# EAGLE design MPU6050 (EAGLE 9.3.0)
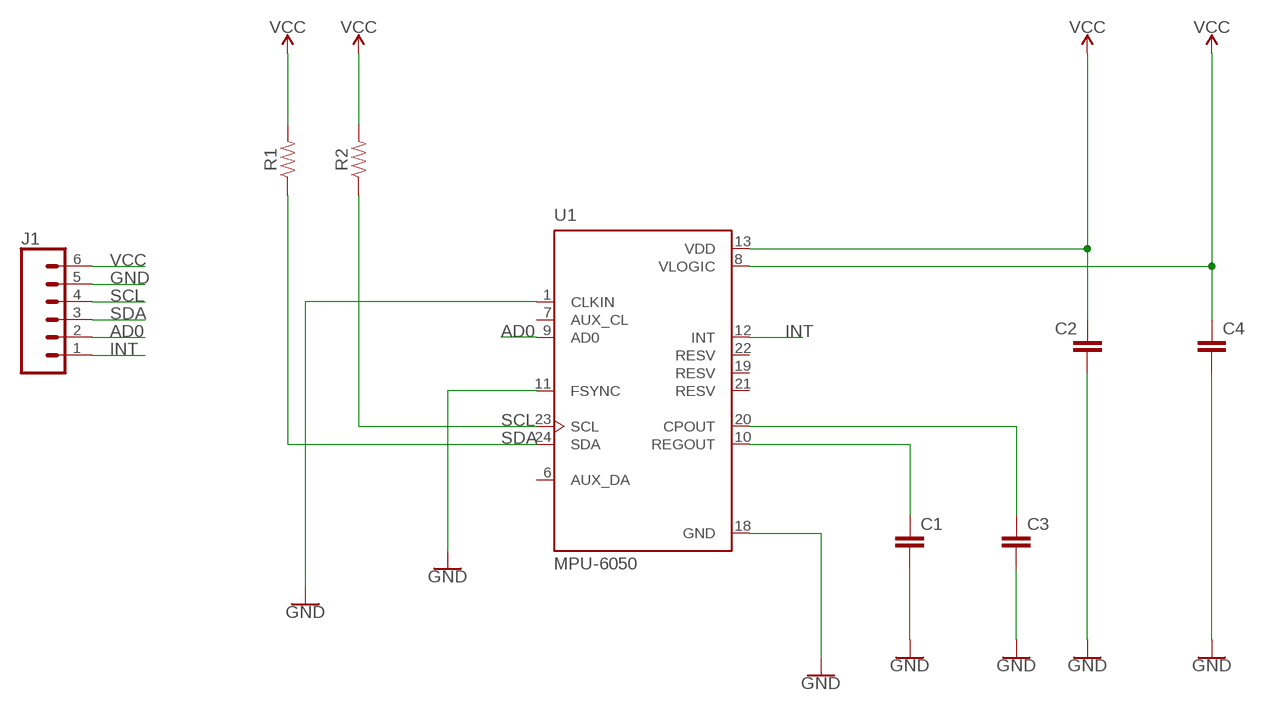
[diagram p0: schematic, sheet 1]

## Parts
C1  C-EU050-035X075  [C050-035X075]
C2  C-EU050-035X075  [C050-035X075]
C3  C-EU050-035X075  [C050-035X075]
C4  C-EU050-035X075  [C050-035X075]
J1  CONN_06NO_SILK_FEMALE_PTH  [1X06_NO_SILK]
R1  RESISTORAXIAL-0.3  [AXIAL-0.3]
R2  RESISTORAXIAL-0.3  [AXIAL-0.3]
U1  MPU-6050  [QFN50P400X400X95-24N]

## Nets
AD0: J1.2 U1.9(AD0)
GND: C1.2 C2.2 C3.2 C4.2 J1.5 U1.1(CLKIN) U1.11(FSYNC) U1.18(GND)
INT: J1.1 U1.12(INT)
N$1: C1.1 U1.10(REGOUT)
N$2: C3.1 U1.20(CPOUT)
SCL: J1.4 R2.P$1 U1.23(SCL)
SDA: J1.3 R1.P$1 U1.24(SDA)
VCC: C2.1 C4.1 J1.6 R1.P$2 R2.P$2 U1.8(VLOGIC) U1.13(VDD)
Unconnected: U1.6(AUX_DA) U1.7(AUX_CL) U1.19(RESV) U1.21(RESV) U1.22(RESV)

## Library data of the parts
C1-C4 = rcl:C-EU: CAPACITOR, European symbol; SPICEPREFIX: C
J1 = SparkFun-Connectors:CONN_06: Multi connection point. Often used as Generic Header-pin footprint for 0.1 inch spaced/style header connections On any of the 0.1 inch spaced packages, you can populate with these: Break Away Headers - Straight <https://www.sparkfun.com/products/116> (PRT-00116) Break Away Male Headers - Right Angle <https://www.sparkfun.com/products/553> (PRT-00553) Female Headers <https://www.sparkfun.com/products/115> (PRT-00115) Break Away Headers - Machine Pin <https://www.sparkfun.com/products/117> (PRT-00117) Break Away Female Headers - Swiss Machine Pin <https://www.sparkfun.com/products/743> (PRT-00743) Arduino Stackable Header - 6 Pin <https://www.sparkfun.com/products/9280> (PRT-09280) For SCREWTERMINALS and SPRING TERMINALS visit here: Screw Terimnals on SparkFun.com <https://www.sparkfun.com/search/results?term=Screw+Terminals> (5mm/3.5mm/2.54mm spacing) This device is also useful as a general connection point to wire up your design to another part of your project. Our various solder wires solder well into these plated through hole pads. Hook-Up Wire - Assortment (Stranded, 22 AWG) <https://www.sparkfun.com/products/11375> (PRT-11375) Hook-Up Wire - Assortment (Solid Core, 22 AWG) <https://www.sparkfun.com/products/11367> (PRT-11367) View the entire wire category on our website here <https://www.sparkfun.com/categories/141>; PROD_ID: CONN-08437
R1 R2 = SparkFun-Resistors:RESISTOR: Generic Resistor Package
U1 = MPU-6050:MPU-6050: MPU-6050 Six-Axis (Gyro + Accelerometer) MEMS MotionTracking™ Devices; DESCRIPTION: 3-axis gyroscope, 3-axis accelerometer in a 4x4x0.9 housing; DIGI-KEY_PART_NUMBER: 1428-1007-1-ND; DIGI-KEY_PURCHASE_URL: https://www.digikey.co.uk/product-detail/en/tdk-invensense/MPU-6050/1428-1007-1-ND/4038010?utm_source=snapeda&utm_medium=aggregator&utm_campaign=symbol; MF: TDK InvenSense; MP: MPU-6050; PACKAGE: QFN-24 InvenSense

## Board
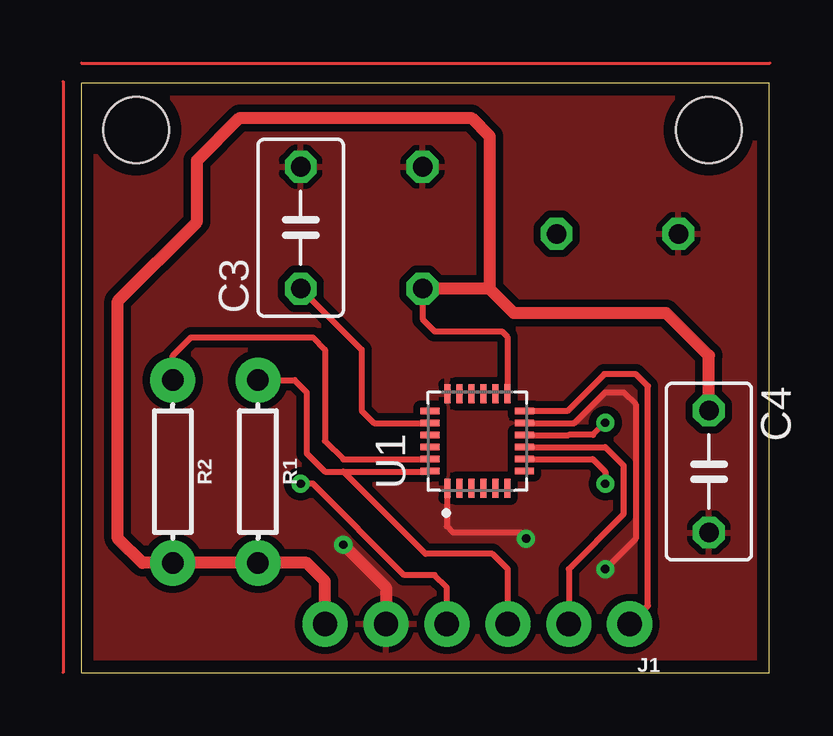
[diagram p1: board, top side]
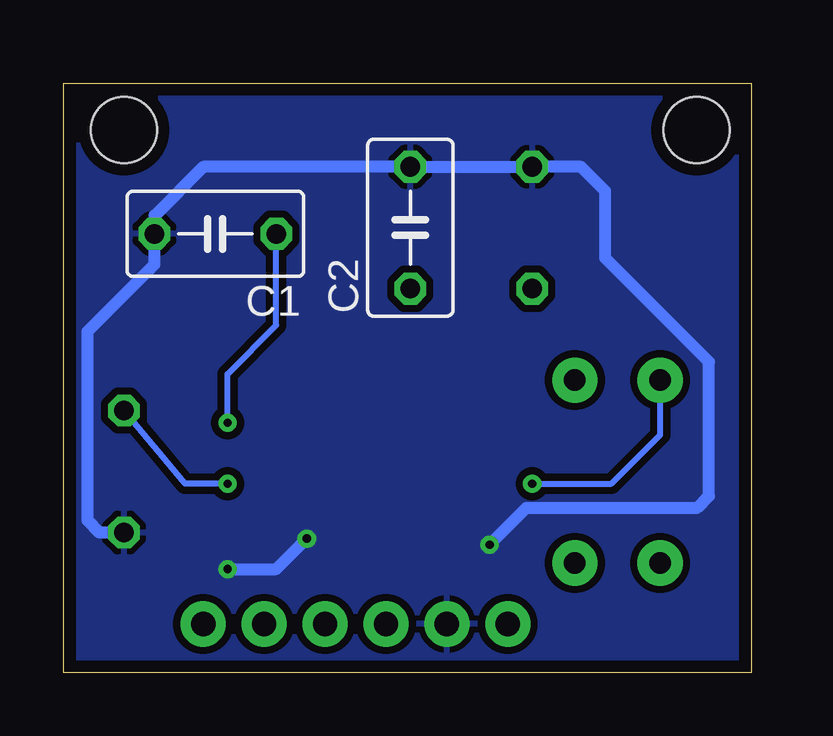
[diagram p2: board, bottom side, seen from below]

Size 28.68 x 24.56 mm. Coordinates in mm from the lower left corner, seen from the top.
Outline: 0,0 28.68,0 28.68,24.56 0,24.56 0,0
Copper layers (1*16): Top 0.035mm / dielectric 1.5mm / Bottom 0.035mm
Design rules "default *": minimum track width 8mil, minimum drill 0.35mm, track to track 8mil, track to pad 8mil, pad to pad 8mil, via to via 8mil, smd to smd 0mil, copper to edge 20mil, drill to drill 6mil, minimum pad ring 10mil, minimum via ring 8mil, stop-mask expansion 4mil, vias tented up to drill 0mil, thermal gap 10mil
Holes 2.75 mm at 2.29,22.61 26.16,22.61

### Footprints (pad centres in the part's own frame; a part is rotated, then mirrored left to right if it is on the bottom)
C050-035X075 = drill 0.813 octagon: 1 -2.54,0; 2 2.54,0
1X06_NO_SILK = drill 1.016 pad 1.88: 1 0,0; 2 2.54,0; 3 5.08,0; 4 7.62,0; 5 10.16,0; 6 12.7,0
AXIAL-0.3 = drill 0.9 pad 1.88: P$1 -3.81,0; P$2 3.81,0
QFN50P400X400X95-24N = smd 0.79 x 0.26: 1 -1.97,1.25; 2 -1.97,0.75; 3 -1.97,0.25; 4 -1.97,-0.25; 5 -1.97,-0.75; 6 -1.97,-1.25; 13 1.97,-1.25; 14 1.97,-0.75; 15 1.97,-0.25; 16 1.97,0.25; 17 1.97,0.75; 18 1.97,1.25 | smd 0.26 x 0.79: 7 -1.25,-1.97; 8 -0.75,-1.97; 9 -0.25,-1.97; 10 0.25,-1.97; 11 0.75,-1.97; 12 1.25,-1.97; 19 1.25,1.97; 20 0.75,1.97; 21 0.25,1.97; 22 -0.25,1.97; 23 -0.75,1.97; 24 -1.25,1.97

### Placement (x,y rotation side)
C1  22.35,18.29 180 bottom
C2  14.22,18.54 90 bottom
C3  9.14,18.54 90 top
C4  26.16,8.38 270 top
J1  22.86,2.03 180 top
R1  7.37,8.38 270 top
R2  3.81,8.38 270 top
U1  16.51,9.65 90 top

### Tracks (layer width: path | path; a pad name or v marks a point on that pad's centre or on a via)
AD0
  Top 0.254: U1.9 21.84,9.4 22.61,8.64 22.61,6.6 20.32,4.32 J1.2
GND  (via drill 0.35)
  Top 0.254: U1.11 20.56,10.4 21.84,11.68 22.61,11.68 23.11,11.18 23.11,5.59 v21.84,4.32 | v18.54,5.59 18.29,5.84 15.49,5.84 15.24,6.1 15.26,6.12 U1.1
  Top 0.508: v10.92,5.33 12.7,3.56 J1.5
  Bottom 0.508: C4.2 27.18,5.84 27.69,6.35 27.69,14.22 24.89,17.02 C1.2 24.89,19.05 22.86,21.08 C2.2 C3.2 7.11,21.08 6.1,20.07 6.1,17.27 1.78,12.95 1.78,7.37 2.29,6.86 9.4,6.86 v10.92,5.33 | v21.84,4.32 19.81,4.32 v18.54,5.59
  pour Top (isolate 0.305): 0,24.64 0,0 28.7,0 28.7,24.64
  pour Bottom (isolate 0.305): 0,24.64 0,0 28.7,0 28.7,24.64
INT
  Top 0.254: J1.1 23.62,2.79 23.62,11.94 23.11,12.45 21.8,12.45 20.26,10.9 U1.12
N$1  (via drill 0.35)
  Top 0.254: U1.10 20.32,9.9 20.32,9.91 21.34,9.91 v21.84,10.41
  Bottom 0.254: v21.84,10.41 21.84,12.45 19.81,14.48 C1.1
N$2
  Top 0.254: C3.1 11.68,13.46 11.68,10.92 12.2,10.4 U1.20
SCL  (via drill 0.35)
  Top 0.254: R2.P$1 3.81,13.21 4.57,13.97 9.65,13.97 10.16,13.46 10.16,9.65 10.92,8.89 10.93,8.9 U1.23 | J1.4 15.24,3.56 14.73,4.06 13.46,4.06 9.65,7.87 v9.14,7.87
  Bottom 0.254: v9.14,7.87 5.84,7.87 3.81,9.91 R2.P$1
SDA
  Top 0.254: R1.P$1 8.89,12.19 9.4,11.68 9.4,9.14 10.16,8.38 10.92,8.38 | 10.92,8.38 14.52,8.38 U1.24 | J1.3 17.78,4.32 17.14,4.95 14.35,4.95 10.92,8.38
VCC  (via drill 0.35)
  Top 0.254: v21.84,7.87 21.84,8.38 21.32,8.9 U1.8 | C2.1 14.22,14.73 14.73,14.22 17.53,14.22 17.76,13.99 U1.13
  Top 0.508: 17.02,16 C2.1 | 17.02,16 17.02,22.35 16.26,23.11 6.6,23.11 4.83,21.34 4.83,18.8 1.52,15.49 1.52,5.59 2.54,4.57 R2.P$2 R1.P$2 9.4,4.57 10.16,3.81 J1.6 | 17.02,16 18.03,14.99 24.38,14.99 26.16,13.21 C4.1
  Bottom 0.254: v21.84,7.87 23.62,7.87 C4.1
(copper drawn outside any net)
  shapes: Top area x2